# Altium schematic sheet Блок1.SchDoc
size A4; SheetNumber: 2; SheetTotal: 2
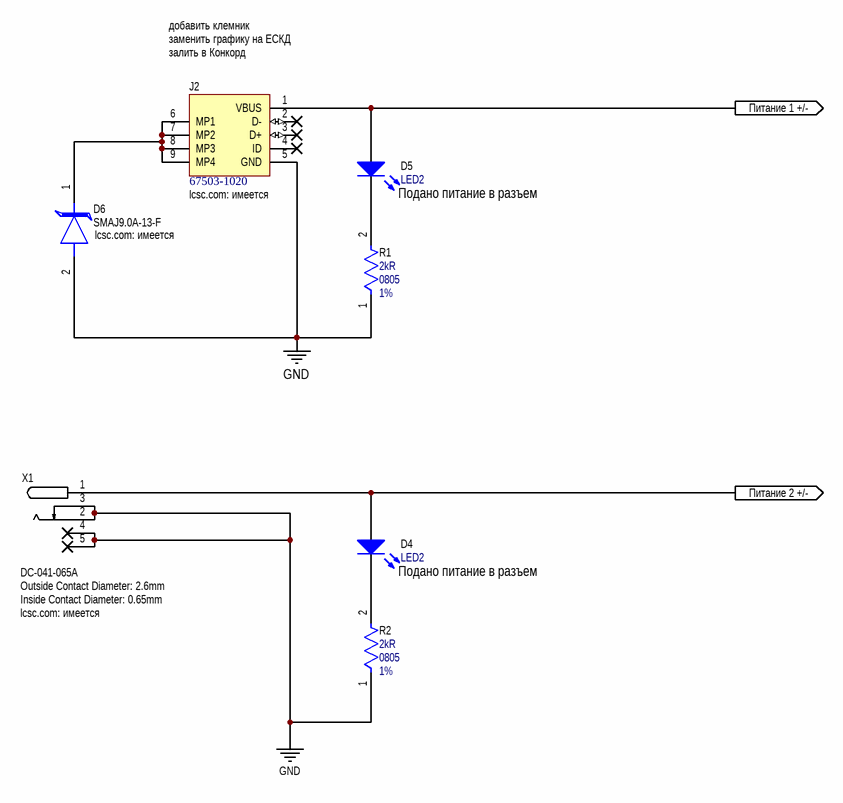
[diagram p0: Блок1.SchDoc]

## Parts
D4  LED2  Parameter 1: Подано питание в разъем  [3.2X1.6X1.1]
D5  LED2  Parameter 1: Подано питание в разъем  [3.2X1.6X1.1]
D6  SMAJ9.0A-13-F  lcsc.com: имеется  [FP-SMA-MFG]
J2  67503-1020  lcsc.com: имеется  [MOLX-67503-1020_V]
R1  Resistance: 2kR  Case/Package: 0805  Tolerance: 1%  [FP-MC01W0805-IPC_C]  (hidden comment: MC01W0805110K)
R2  Resistance: 2kR  Case/Package: 0805  Tolerance: 1%  [FP-MC01W0805-IPC_C]  (hidden comment: MC01W0805110K)
X1  DC-041-065A  Inside Contact Diameter: 0.65mm  Outside Contact Diameter: 2.6mm  lcsc.com: имеется  [DC-041-065A]

## Ports
Питание 1 +/- (out), Питание 2 +/- (out)

## Nets
GND: D6.2(A) J2.5(GND) R1.1 R2.1 X1.2 X1.3 X1.4 X1.5
Питание 1 +/-: D5.1(A) J2.1(VBUS) ; port Питание 1 +/-
Питание 2 +/-: D4.1(A) X1.1 ; port Питание 2 +/-
NetD4_2: D4.2(K) R2.2
NetD5_2: D5.2(K) R1.2
NetD6_1: D6.1(C) J2.6(MP1) J2.7(MP2) J2.8(MP3) J2.9(MP4)

Not connected (* = marked no-connect by the designer): J2 2(D-)* 3(D+)* 4(ID)*

## Notes on the sheet
- добавить клемник
- заменить графику на ЕСКД
- (near J2) залить в Конкорд

## Library data of the parts
D4 D5 = LED2: Typical RED, GREEN, YELLOW, AMBER GaAs LED; Published: 8-Jun-2000; LatestRevisionDate: 17-Jul-2002; LatestRevisionNote: Re-released for DXP Platform.; PackageVersion: Feb-2002; PackageReference: 3.2X1.6X1.1; Publisher: Altium Limited; PackageDescription: SM LED; 2 Flat Leads
D6 = CMP-12828-000014-1: TVS DIODE 9V 15.4V SMA; Manufacturer: Diodes Inc; Number Of Channels: 1; Standoff Height: 0.05mm; Max Junction Temp: +150°C; Direction: Unidirectional; Breakdown Voltage: 10V; Peak Pulse Current: 26A; Peak Pulse Power: 400W; Category: Diode; Footprint Url: https://www.diodes.com/assets/Package-Files/SMA.pdf; Lead Free: Yes; Mouser Description: TVS Diodes - Transient Voltage Suppressors 400W 9.0V; Automotive: No; Temperature Range Low: -55°C; Temperature Range High: +150°C; Manufacturer Part Number: SMAJ9.0A-13-F; RoHS: TRUE; Octopart: https://octopart.com/smaj9.0a-13-f-diodes+inc.-350369; Device Class L3: unset; Device Class L2: TVS Diodes; Clamping Voltage: 15.4V; Temperature: -55°C to +150°C; ComponentLink2Description: Datasheet; Package: SMA; Reverse Standoff Voltage: 9V; Digikey Description: TVS DIODE 9V 15.4V SMA; Height: 2.4mm; ComponentLink2URL: https://www.diodes.com/assets/Datasheets/ds19005.pdf; Device Class L1: Circuit Protection; lcsc.com link: https://lcsc.com/product-detail/TVS_Diodes-Incorporated-SMAJ9-0CA-13-F_C135023.html
J2 = CMP-0411-00002-1: USB, MINI, SMD, RA KME04-USBMU03A01; Manufacturer: Molex; ComponentLink1URL: http://www.molex.com/; PartNumber: 67503-1020; Mounting Technology: Surface Mount; ComponentLink1Description: Manufacturer URL; Terminal Pitch: 0.8 mm; DatasheetVersion: Rev F, 06/2009; ComponentLink2Description: Datasheet; PackageDescription: Mini USB Connector, SMT, Righer Angle; ComponentLink2URL: http://www.molex.com/pdm_docs/sd/675031020_sd.pdf; PackageReference: 67503-1020; lcsc.com/product: https://lcsc.com/product-detail/USB-Connectors_MOLEX-675031020_C136451.html
R1 R2 = CMP-12256-000003-1: Resistor, 10K, 0.1W, 1%, 0805, Reel; Manufacturer: Multicomp; Voltage Rating: 150V; Temperature Coefficient: 100ppm/°C; Power Rating: 100mW; REACH SVHC: No SVHC; Composition: Thick Film; Max Operating Temperature: 155°C; Number of Pins: 2; Case Code (Metric): 2012; Voltage Rating (DC): 150V; Min Operating Temperature: -55°C; Width: 1.25mm; Case Code (Imperial): 0805; Packaging: Cut Tape; Supplier 1: Newark; Supplier Part Number 1: 07W5303; Manufacturer Part Number: MC01W0805110K; RoHS: No; Category: Chip SMD Resistors; Stock 1: 940000; Pricing 1: 1=0,00900, 5000=0,00900, 10000=0,00800, 25000=0,00600 (USD); Series: MC; Resistor Type: Thick Film; Resistance Tolerance: 1%; RoHS Compliant: No; ComponentLink1URL: https://datasheet.ciiva.com/7881/1729047-7881334.pdf?src-supplier=Element14; ComponentLink1Description: https://datasheet.ciiva.com/7881/1729047-7881334.pdf?src-supplier=Element14; ComponentLink2URL: https://datasheet.ciiva.com/7881/1729047-7881333.pdf?src-supplier=Element14; ComponentLink2Description: https://datasheet.ciiva.com/7881/1729047-7881333.pdf?src-supplier=Element14
X1 = DC-041-065A: Surface Mount DC Power Receptacle 0.65mm -20℃~+70℃ 2.6mm 500mA 30V SMD AC/DC Power Connectors ROHS; BOM_Manufacturer: Rectangular Connectors - Contacts; Contributor: LCSC; BOM_Supplier: LCSC; BOM_Supplier Part: C192728; BOM_Manufacturer Part: DC-041-065A; BOM_JLCPCB Part Class: Extended Part; spicePre: D; spiceSymbolName: DC-041; Parameter 1: https://lcsc.com/product-detail/AC-DC-Power-Connectors_Korean-Hroparts-Elec-DC-041-065A_C192728.html